# Altium schematic sheet Sheet1.SchDoc
size A4
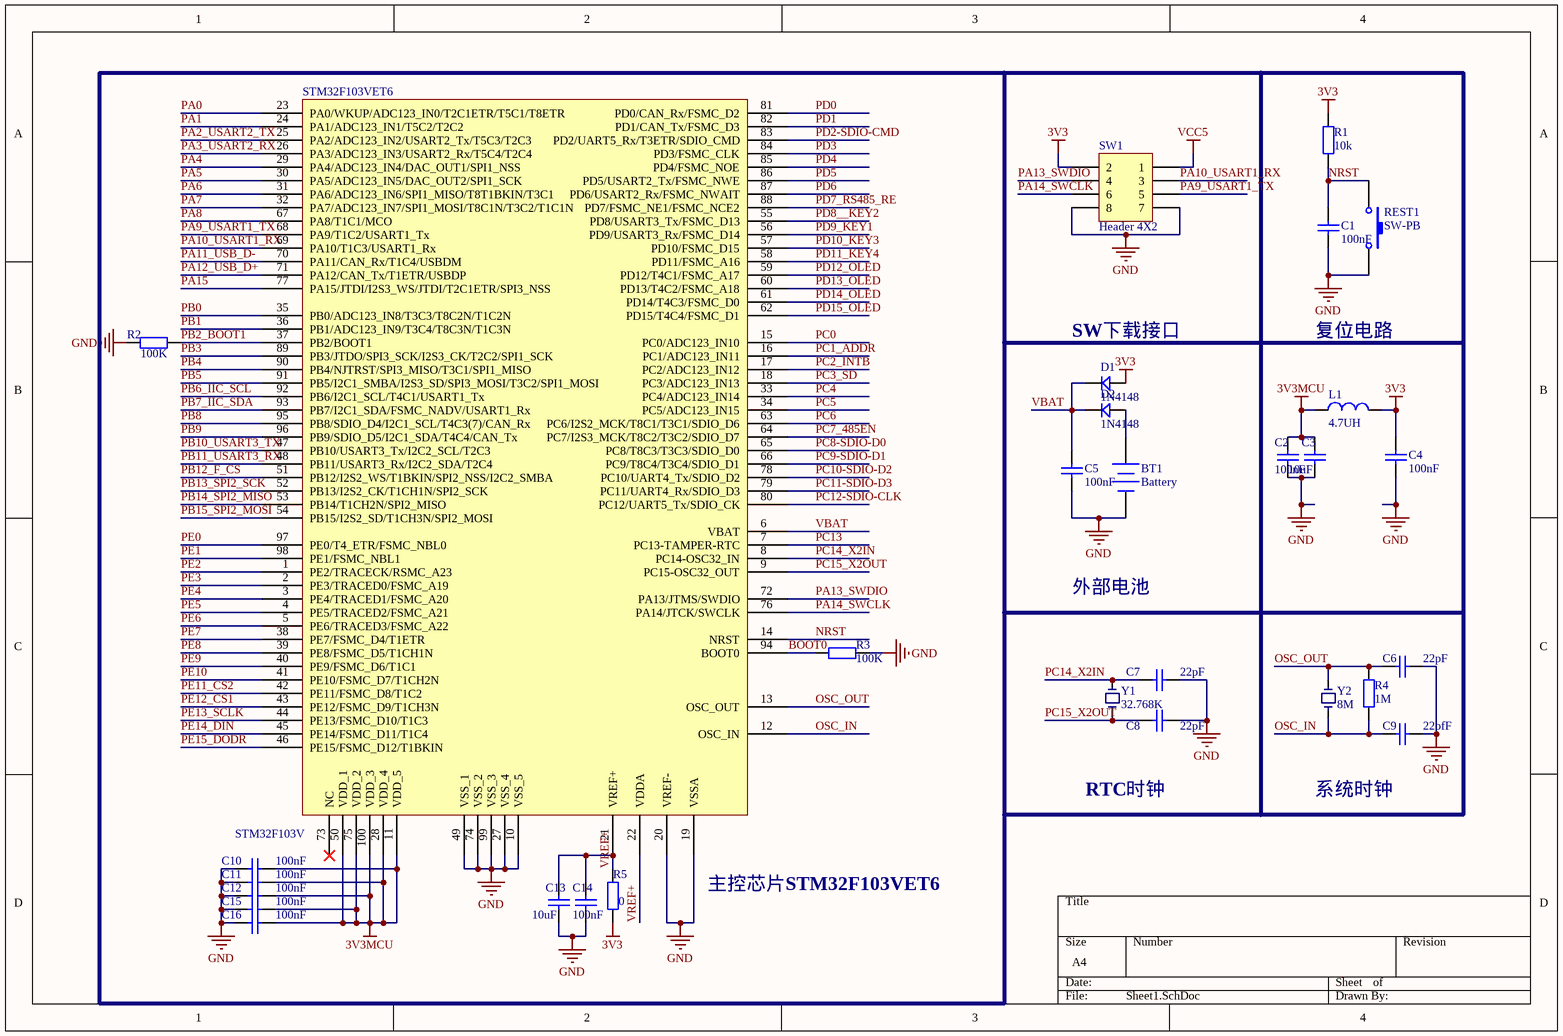
[diagram p0: Sheet1.SchDoc]

## Parts
BT1  Battery  [BATTERY_CR1220]
C1  100nF  [LC-0603_C]
C2  100nF  [LC-0603_C]
C3  10uF  [LC-0805_C]
C4  100nF  [LC-0603_C]
C5  100nF  [LC-0603_C]
C6  22pF  [LC-0603_C]
C7  22pF  [LC-0603_C]
C8  22pF  [LC-0603_C]
C9  22pfF  [LC-0603_C]
C10  100nF  [LC-0603_C]
C11  100nF  [LC-0603_C]
C12  100nF  [LC-0603_C]
C13  10uF  [LC-0805_C]
C14  100nF  [LC-0603_C]
C15  100nF  [LC-0603_C]
C16  100nF  [LC-0603_C]
D1  1N4148  [DIODE_SOP]
D2  1N4148  [DIODE_SOP]
L1  4.7UH  [LC-0805_L]
R1  10k  [LC-0603_R]
R2  100K  [LC-0603_R]
R3  100K  [LC-0603_R]
R4  1M  [LC-0603_R]
R5  0  [LC-0603_R]
REST1  SW-PB  [SW-SMD1]
STM32F103VET6  STM32F103V  [LQFP-100_M]
SW1  Header 4X2  [HDR2X4]
Y1  32.768K  [XTAL-长形 贴片]
Y2  8M  [XTAL 直插]

## Nets
3V3: C4.2 D1.1 L1.2 R1.1 R5.1 SW1.2
3V3MCU: C2.2 C3.2 C10.2 C11.2 C12.2 C15.2 C16.2 L1.1 STM32F103VET6.11(VDD_5) STM32F103VET6.28(VDD_4) STM32F103VET6.50(VDD_1) STM32F103VET6.75(VDD_2) STM32F103VET6.100(VDD_3)
GND: BT1.2(-) C1.2 C2.1 C3.1 C4.1 C5.1 C6.2 C7.2 C8.2 C9.2 C10.1 C11.1 C12.1 C13.1 C14.1 C15.1 C16.1 R2.2 R3.1 REST1.2 STM32F103VET6.10(VSS_5) STM32F103VET6.19(VSSA) STM32F103VET6.20(VREF-) STM32F103VET6.27(VSS_4) STM32F103VET6.49(VSS_1) STM32F103VET6.74(VSS_2) STM32F103VET6.99(VSS_3) SW1.7 SW1.8
VCC5: SW1.1
BOOT0: R3.2 STM32F103VET6.94(BOOT0)
NRST: C1.1 R1.2 REST1.1 STM32F103VET6.14(NRST)
OSC_IN: C9.1 R4.1 STM32F103VET6.12(OSC_IN) Y2.1
OSC_OUT: C6.1 R4.2 STM32F103VET6.13(OSC_OUT) Y2.2
PA0: STM32F103VET6.23(PA0/WKUP/ADC123_IN0/T2C1ETR/T5C1/T8ETR)
PA1: STM32F103VET6.24(PA1/ADC123_IN1/T5C2/T2C2)
PA2_USART2_TX: STM32F103VET6.25(PA2/ADC123_IN2/USART2_Tx/T5C3/T2C3)
PA3_USART2_RX: STM32F103VET6.26(PA3/ADC123_IN3/USART2_Rx/T5C4/T2C4)
PA4: STM32F103VET6.29(PA4/ADC123_IN4/DAC_OUT1/SPI1_NSS)
PA5: STM32F103VET6.30(PA5/ADC123_IN5/DAC_OUT2/SPI1_SCK)
PA6: STM32F103VET6.31(PA6/ADC123_IN6/SPI1_MISO/T8T1BKIN/T3C1)
PA7: STM32F103VET6.32(PA7/ADC123_IN7/SPI1_MOSI/T8C1N/T3C2/T1C1N)
PA8: STM32F103VET6.67(PA8/T1C1/MCO)
PA9_USART1_TX: STM32F103VET6.68(PA9/T1C2/USART1_Tx) SW1.5
PA10_USART1_RX: STM32F103VET6.69(PA10/T1C3/USART1_Rx) SW1.3
PA11_USB_D-: STM32F103VET6.70(PA11/CAN_Rx/T1C4/USBDM)
PA12_USB_D+: STM32F103VET6.71(PA12/CAN_Tx/T1ETR/USBDP)
PA13_SWDIO: STM32F103VET6.72(PA13/JTMS/SWDIO) SW1.4
PA14_SWCLK: STM32F103VET6.76(PA14/JTCK/SWCLK) SW1.6
PA15: STM32F103VET6.77(PA15/JTDI/I2S3_WS/JTDI/T2C1ETR/SPI3_NSS)
PB0: STM32F103VET6.35(PB0/ADC123_IN8/T3C3/T8C2N/T1C2N)
PB1: STM32F103VET6.36(PB1/ADC123_IN9/T3C4/T8C3N/T1C3N)
PB2_BOOT1: R2.1 STM32F103VET6.37(PB2/BOOT1)
PB3: STM32F103VET6.89(PB3/JTDO/SPI3_SCK/I2S3_CK/T2C2/SPI1_SCK)
PB4: STM32F103VET6.90(PB4/NJTRST/SPI3_MISO/T3C1/SPI1_MISO)
PB5: STM32F103VET6.91(PB5/I2C1_SMBA/I2S3_SD/SPI3_MOSI/T3C2/SPI1_MOSI)
PB6_IIC_SCL: STM32F103VET6.92(PB6/I2C1_SCL/T4C1/USART1_Tx)
PB7_IIC_SDA: STM32F103VET6.93(PB7/I2C1_SDA/FSMC_NADV/USART1_Rx)
PB8: STM32F103VET6.95(PB8/SDIO_D4/I2C1_SCL/T4C3(7)/CAN_Rx)
PB9: STM32F103VET6.96(PB9/SDIO_D5/I2C1_SDA/T4C4/CAN_Tx)
PB10_USART3_TX: STM32F103VET6.47(PB10/USART3_Tx/I2C2_SCL/T2C3)
PB11_USART3_RX: STM32F103VET6.48(PB11/USART3_Rx/I2C2_SDA/T2C4)
PB12_F_CS: STM32F103VET6.51(PB12/I2S2_WS/T1BKIN/SPI2_NSS/I2C2_SMBA)
PB13_SPI2_SCK: STM32F103VET6.52(PB13/I2S2_CK/T1CH1N/SPI2_SCK)
PB14_SPI2_MISO: STM32F103VET6.53(PB14/T1CH2N/SPI2_MISO)
PB15_SPI2_MOSI: STM32F103VET6.54(PB15/I2S2_SD/T1CH3N/SPI2_MOSI)
PC0: STM32F103VET6.15(PC0/ADC123_IN10)
PC1_ADDR: STM32F103VET6.16(PC1/ADC123_IN11)
PC2_INTB: STM32F103VET6.17(PC2/ADC123_IN12)
PC3_SD: STM32F103VET6.18(PC3/ADC123_IN13)
PC4: STM32F103VET6.33(PC4/ADC123_IN14)
PC5: STM32F103VET6.34(PC5/ADC123_IN15)
PC6: STM32F103VET6.63(PC6/I2S2_MCK/T8C1/T3C1/SDIO_D6)
PC7_485EN: STM32F103VET6.64(PC7/I2S3_MCK/T8C2/T3C2/SDIO_D7)
PC8-SDIO-D0: STM32F103VET6.65(PC8/T8C3/T3C3/SDIO_D0)
PC9-SDIO-D1: STM32F103VET6.66(PC9/T8C4/T3C4/SDIO_D1)
PC10-SDIO-D2: STM32F103VET6.78(PC10/UART4_Tx/SDIO_D2)
PC11-SDIO-D3: STM32F103VET6.79(PC11/UART4_Rx/SDIO_D3)
PC12-SDIO-CLK: STM32F103VET6.80(PC12/UART5_Tx/SDIO_CK)
PC13: STM32F103VET6.7(PC13-TAMPER-RTC)
PC14_X2IN: C7.1 STM32F103VET6.8(PC14-OSC32_IN) Y1.2
PC15_X2OUT: C8.1 STM32F103VET6.9(PC15-OSC32_OUT) Y1.1
PD0: STM32F103VET6.81(PD0/CAN_Rx/FSMC_D2)
PD1: STM32F103VET6.82(PD1/CAN_Tx/FSMC_D3)
PD2-SDIO-CMD: STM32F103VET6.83(PD2/UART5_Rx/T3ETR/SDIO_CMD)
PD3: STM32F103VET6.84(PD3/FSMC_CLK)
PD4: STM32F103VET6.85(PD4/FSMC_NOE)
PD5: STM32F103VET6.86(PD5/USART2_Tx/FSMC_NWE)
PD6: STM32F103VET6.87(PD6/USART2_Rx/FSMC_NWAIT)
PD7_RS485_RE: STM32F103VET6.88(PD7/FSMC_NE1/FSMC_NCE2)
PD8__KEY2: STM32F103VET6.55(PD8/USART3_Tx/FSMC_D13)
PD9_KEY1: STM32F103VET6.56(PD9/USART3_Rx/FSMC_D14)
PD10_KEY3: STM32F103VET6.57(PD10/FSMC_D15)
PD11_KEY4: STM32F103VET6.58(PD11/FSMC_A16)
PD12_OLED: STM32F103VET6.59(PD12/T4C1/FSMC_A17)
PD13_OLED: STM32F103VET6.60(PD13/T4C2/FSMC_A18)
PD14_OLED: STM32F103VET6.61(PD14/T4C3/FSMC_D0)
PD15_OLED: STM32F103VET6.62(PD15/T4C4/FSMC_D1)
PE0: STM32F103VET6.97(PE0/T4_ETR/FSMC_NBL0)
PE1: STM32F103VET6.98(PE1/FSMC_NBL1)
PE2: STM32F103VET6.1(PE2/TRACECK/RSMC_A23)
PE3: STM32F103VET6.2(PE3/TRACED0/FSMC_A19)
PE4: STM32F103VET6.3(PE4/TRACED1/FSMC_A20)
PE5: STM32F103VET6.4(PE5/TRACED2/FSMC_A21)
PE6: STM32F103VET6.5(PE6/TRACED3/FSMC_A22)
PE7: STM32F103VET6.38(PE7/FSMC_D4/T1ETR)
PE8: STM32F103VET6.39(PE8/FSMC_D5/T1CH1N)
PE9: STM32F103VET6.40(PE9/FSMC_D6/T1C1)
PE10: STM32F103VET6.41(PE10/FSMC_D7/T1CH2N)
PE11_CS2: STM32F103VET6.42(PE11/FSMC_D8/T1C2)
PE12_CS1: STM32F103VET6.43(PE12/FSMC_D9/T1CH3N)
PE13_SCLK: STM32F103VET6.44(PE13/FSMC_D10/T1C3)
PE14_DIN: STM32F103VET6.45(PE14/FSMC_D11/T1C4)
PE15_DODR: STM32F103VET6.46(PE15/FSMC_D12/T1BKIN)
VBAT: C5.2 D1.2 D2.2 STM32F103VET6.6(VBAT)
VREF+: C13.2 C14.2 R5.2 STM32F103VET6.21(VREF+) STM32F103VET6.22(VDDA)
NetBT1_1: BT1.1(+) D2.1

Not connected (* = marked no-connect by the designer): STM32F103VET6 73(NC)*

## Notes on the sheet
- (near D1) SW下载接口
- 复位电路
- 外部电池
- RTC时钟
- 系统时钟
- 主控芯片STM32F103VET6

## Library data of the parts
BT1 = Battery: 备份电池; Published: 24-Mar-1999; LatestRevisionDate: 17-Jul-2002; LatestRevisionNote: Re-released for DXP Platform.; PackageReference: BAT-2; Publisher: Altium Limited
C1 C2 C4-C12 C14-C16 = Cap: 无极性电容; Published: 8-Jun-2000; LatestRevisionDate: 17-Jul-2002; LatestRevisionNote: Re-released for DXP Platform.; PackageReference: RAD-0.3; Publisher: Altium Limited
C3 C13 = 0805 1.0pF (010) 0.25pF 50V: 贴片电容; ComponentLink1Description: 供应商链接; ComponentLink1URL: http://www.szlcsc.com/product/details_15644.html; Package: 0805; Supplier: LC; SuppliersPartNumber: C14971
D1 D2 = D
L1 = 电感
R1-R5 = Res1: 贴片电阻; Value: 1K; Published: 8-Jun-2000; LatestRevisionDate: 17-Jul-2002; LatestRevisionNote: Re-released for DXP Platform.; PackageReference: AXIAL-0.4; Publisher: Altium Limited
REST1 = SW-PB: Switch; Published: 24-Mar-1999; LatestRevisionDate: 17-Jul-2002; LatestRevisionNote: Re-released for DXP Platform.; PackageReference: SPST-2; Publisher: Altium Limited; PackageDescription: Switch; 2 Leads
STM32F103VET6 = STM32F103V: STM32单片机100引脚
SW1 = Header 4X2: Header, 4-Pin, Dual row; LatestRevisionDate: 17-Jul-2002; LatestRevisionNote: Re-released for DXP Platform.; Publisher: Altium Limited
Y1 Y2 = 晶振